# EasyEDA Pro project 2021_ZT_2.eprj

# Schematic user
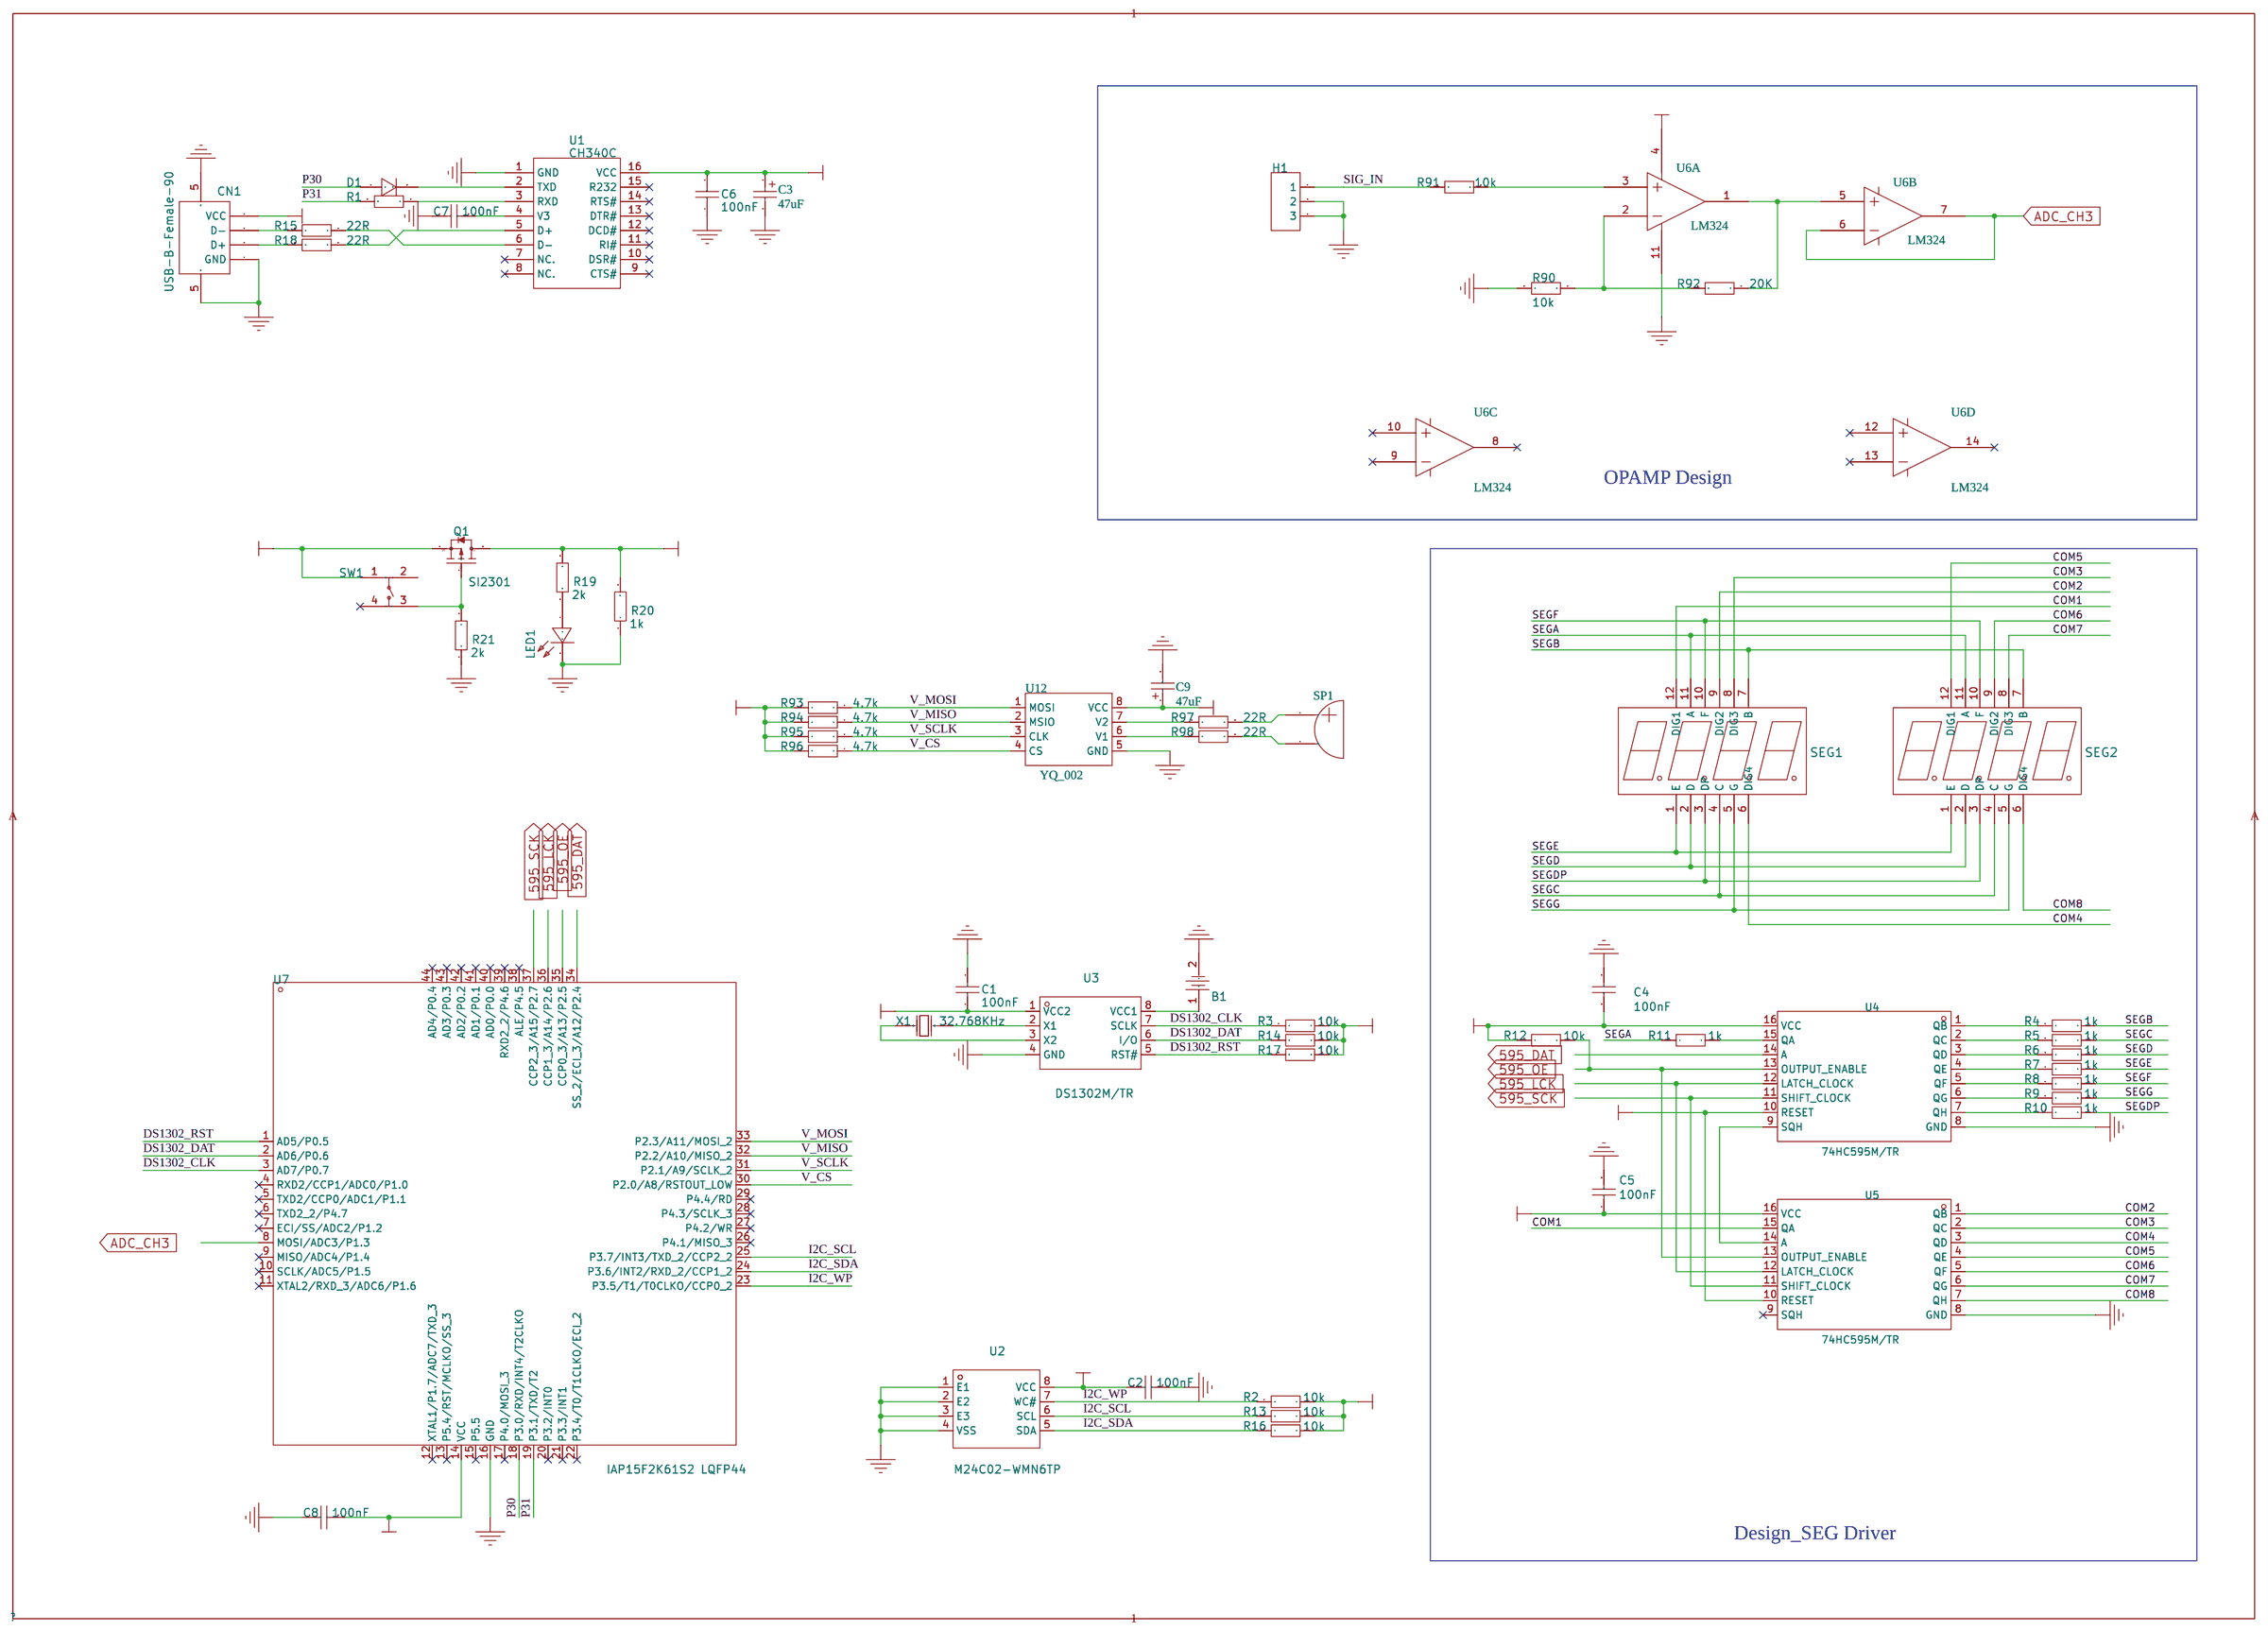
[diagram p0: schematic sheet]

## Parts
B1  CR1220-2  [BAT-CR1220]
C1  100nF  [C0805]
C2  100nF  [C0805]
C3  47uF  [CAP]
C4  100nF  [C0805]
C5  100nF  [C0805]
C6  100nF  [C0805]
C7  100nF  [C0805]
C8  100nF  [C0805]
C9  47uF  [CAP]
CN1  USB-B-Female-90  [USB-B]
D1  KLL4148  [DIODE]
H1  HDR-F-2.54_1x3  [HDR-F-2.54_1X3]
LED1  17-21URC/TR8  [LED0805]
Q1  SI2301  [SOT-23-3]
R1  1k  [R0805]
R2  10k  [R0805]
R3  10k  [R0805]
R4  1k  [R0805]
R5  1k  [R0805]
R6  1k  [R0805]
R7  1k  [R0805]
R8  1k  [R0805]
R9  1k  [R0805]
R10  1k  [R0805]
R11  1k  [R0805]
R12  10k  [R0805]
R13  10k  [R0805]
R14  10k  [R0805]
R15  22R  [R0805]
R16  10k  [R0805]
R17  10k  [R0805]
R18  22R  [R0805]
R19  2k  [R0805]
R20  1k  [R0805]
R21  2k  [R0805]
R90  10k  [R0805]
R91  10k  [R0805]
R92  20K  [R0805]
R93  4.7k  [R0805]
R94  4.7k  [R0805]
R95  4.7k  [R0805]
R96  4.7k  [R0805]
R97  22R  [R0805]
R98  22R  [R0805]
SEG1  DSP  [led-seg-th_12p-l30.0-w14.0-p2.54-s10.16-bl]
SEG2  DSP  [led-seg-th_12p-l30.0-w14.0-p2.54-s10.16-bl]
SP1  BUZZER  [BUZZ]
SW1  TS-1159UB-B-D-BL  [SW-SMD_4P]
U1  CH340C  [SOP-16]
U2  M24C02-WMN6TP  [SOP-8]
U3  DS1302M/TR  [SOP-8]
U4  74HC595M/TR  [sop-16]
U5  74HC595M/TR  [sop-16]
U6  LM324  [SO-14]  (sections 1,2,3,4)
U7  IAP15F2K61S2 LQFP44  [LQFP-44]
U12  YQ_002  [BW-SOP-8]
X1  32.768KHz  [XTAL-DT38]

## Library data of the parts
B1 = CR1220-2: Supplier: LCSC; Manufacturer: Q&amp;J; image: //image.lceda.cn/szlcsc/C70381.jpg; Supplier Part: C70381
C1 C2 C4-C8 = 100nF: Supplier: LCSC; Manufacturer: FH; Manufacturer Part: 0805F104M500NT; Supplier Part: C28378
C3 C9 = 47uF: Polarized Capacitor (Axial); Design Item ID: Cap Pol2; Library Name: Miscellaneous Devices
CN1 = USB-B-Female-90: Supplier: LCSC; Manufacturer: ValuePro; Manufacturer Part: USB-BF90; image: //image.lceda.cn/szlcsc/C46392.jpg; Supplier Part: C46392
D1 = KLL4148: Supplier: LCSC; Supplier Part: C369941; Manufacturer: KEXIN
H1 = HDR-F-2.54_1x3: Supplier Part: C146690; Supplier: LCSC; Library Name: CT105
LED1 = 17-21URC/TR8: Supplier: LCSC; Supplier Part: C264414; Manufacturer: Everlight Elec
Q1 = SI2301: Supplier: LCSC; Manufacturer: Hottech; Supplier Part: C181086; JLCPCB Part Class: Extend
R1 R20 = 1k: Supplier: LCSC; Manufacturer: UniOhm; Manufacturer Part: 080500J0104T5E; Supplier Part: C149503
R2-R14 R16 R17 = 10k: Supplier: LCSC; Manufacturer: UniOhm; Manufacturer Part: 080500J0104T5E; Supplier Part: C149503
R15 R18 R97 R98 = 22R: Supplier: LCSC; Manufacturer: UniOhm; Manufacturer Part: 080500J0104T5E; Supplier Part: C149503; Design Item ID: 1k
R19 R21 = 2k: Supplier: LCSC; Manufacturer: UniOhm; Manufacturer Part: 080500J0104T5E; Supplier Part: C149503
R90 R91 = 10k: Supplier: LCSC; Manufacturer: UniOhm; Manufacturer Part: 080500J0104T5E; Supplier Part: C149503; Design Item ID: 1k
R92 = ?: Supplier: LCSC; Manufacturer: UniOhm; Manufacturer Part: 080500J0104T5E; Supplier Part: C149503; Design Item ID: 1k
R93-R96 = 4.7k: Supplier: LCSC; Manufacturer: UniOhm; Manufacturer Part: 080500J0104T5E; Supplier Part: C149503; Design Item ID: 1k
SEG1 SEG2 = SR420361N: Supplier: LCSC; Supplier Part: C98926; Manufacturer: Wuxi ARK Tech Elec
SP1 = BUZZER: Buzzer; Library Name: *
SW1 = TS-1159UB-B-D-BL: Supplier: LCSC; Supplier Part: C692480; Manufacturer: XKB Connectivity
U1 = CH340C: Supplier: LCSC; Manufacturer: WCH; Supplier Part: C84681; JLCPCB Part Class: Extend
U2 = M24C02-WMN6TP: Supplier: LCSC; Manufacturer: STMicroelectronics; image: //image.lceda.cn/szlcsc/C7562.jpg; Supplier Part: C7562; JLCPCB Part Class: Basic
U3 = DS1302M/TR: Supplier: LCSC; Supplier Part: C434511; Manufacturer: HGSEMI
U4 U5 = 74HC595M/TR
U6 = LM324: Design Item ID: LM124; Library Name: *
U7 = IAP15F2K61S2 LQFP44: Supplier: LCSC; Manufacturer: STC; Supplier Part: C47451; JLCPCB Part Class: Extend
U12 = YQ_002: Design Item ID: LQ2021; Library Name: CT105
X1 = 32.768KHz: Supplier: LCSC; Supplier Part: C252404; Manufacturer: SHENZHEN CRYSTAL TECH; Manufacturer Part: 6K832768F12UB

## Nets
+5V: C1.1 C2.1 C4.1 C5.1 C8.2 C9.1 Q1.3(D) R2.2 R3.2 R12.1 R13.2 R14.2 R16.2 R17.2 R19.2 R20.2 R93.2 R94.2 R95.2 R96.2 U2.8(VCC) U3.1(VCC2) U4.10(RESET) U4.16(VCC) U5.10(RESET) U5.16(VCC) U6.4 U7.14(VCC) U12.8(VCC)
GND: B1.2 C1.2 C2.2 C3.2 C4.2 C5.2 C6.1 C7.1 C8.1 C9.2 CN1.4(GND) CN1.5(SH2) H1.2 H1.3 LED1.2(K) R20.1 R21.1 R90.2 U1.1(GND) U2.1(E1) U2.2(E2) U2.3(E3) U2.4(VSS) U3.4(GND) U4.8(GND) U5.8(GND) U6.11 U7.16(GND) U12.5(GND)
595_DAT: U4.14(A) U7.34(SS_2/ECI_3/A12/P2.4)
595_LCK: U4.12(LATCH_CLOCK) U5.12(LATCH_CLOCK) U7.36(CCP1_3/A14/P2.6)
595_OE: R12.2 U4.13(OUTPUT_ENABLE) U5.13(OUTPUT_ENABLE) U7.35(CCP0_3/A13/P2.5)
595_SCK: U4.11(SHIFT_CLOCK) U5.11(SHIFT_CLOCK) U7.37(CCP2_3/A15/P2.7)
ADC_CH3: U6.6 U6.7 U7.8(MOSI/ADC3/P1.3)
COM1: SEG1.12(DIG1) U5.15(QA)
COM2: SEG1.9(DIG2) U5.1(QB)
COM3: SEG1.8(DIG3) U5.2(QC)
COM4: SEG1.6(DIG4) U5.3(QD)
COM5: SEG2.12(DIG1) U5.4(QE)
COM6: SEG2.9(DIG2) U5.5(QF)
COM7: SEG2.8(DIG3) U5.6(QG)
COM8: SEG2.6(DIG4) U5.7(QH)
DS1302_CLK: R3.1 U3.7(SCLK) U7.3(AD7/P0.7)
DS1302_DAT: R14.1 U3.6(I/O) U7.2(AD6/P0.6)
DS1302_RST: R17.1 U3.5(RST#) U7.1(AD5/P0.5)
I2C_SCL: R13.1 U2.6(SCL) U7.25(P3.7/INT3/TXD_2/CCP2_2)
I2C_SDA: R16.1 U2.5(SDA) U7.24(P3.6/INT2/RXD_2/CCP1_2)
I2C_WP: R2.1 U2.7(WC#) U7.23(P3.5/T1/T0CLKO/CCP0_2)
P30: D1.2(A) U7.18(P3.0/RXD/INT4/T2CLKO)
P31: R1.2 U7.19(P3.1/TXD/T2)
SEGA: R11.1 SEG1.11(A) SEG2.11(A)
SEGB: R4.2 SEG1.7(B) SEG2.7(B)
SEGC: R5.2 SEG1.4(C) SEG2.4(C)
SEGD: R6.2 SEG1.2(D) SEG2.2(D)
SEGDP: R10.2 SEG1.3(DP) SEG2.3(DP)
SEGE: R7.2 SEG1.1(E) SEG2.1(E)
SEGF: R8.2 SEG1.10(F) SEG2.10(F)
SEGG: R9.2 SEG1.5(G) SEG2.5(G)
SIG_IN: H1.1 R91.2
V_CS: R96.1 U7.30(P2.0/A8/RSTOUT_LOW) U12.4(CS)
V_MISO: R94.1 U7.32(P2.2/A10/MISO_2) U12.2(MSIO)
V_MOSI: R93.1 U7.33(P2.3/A11/MOSI_2) U12.1(MOSI)
V_SCLK: R95.1 U7.31(P2.1/A9/SCLK_2) U12.3(CLK)
VUSB: C3.1 C6.2 CN1.1(VCC) Q1.2(S) SW1.1 U1.16(VCC)
$1N560: U3.2(X1) X1.2(OSC2)
$1N561: U3.3(X2) X1.1(OSC1)
$1N593: B1.1 U3.8(VCC1)
$1N600: R1.1 U1.3(RXD)
$1N601: D1.1(C) U1.2(TXD)
$1N604: C7.2 U1.4(V3)
$1N605: CN1.2(D-) R15.2
$1N606: CN1.3(D+) R18.2
$1N607: R15.1 U1.6(D-)
$1N608: R18.1 U1.5(D+)
$1N627: Q1.1(G) R21.2 SW1.3
$1N632: R91.1 U6.3
$1N637: R92.1 U6.1 U6.5
$1N638: R90.1 R92.2 U6.2
$1N646: R98.1 U12.6(V1)
$1N647: R97.1 U12.7(V2)
$1N661: R97.2 SP1.1
$1N662: R98.2 SP1.2
$1N687: LED1.1(A) R19.1
$1N2494: R11.2 U4.15(QA)
$1N2978: R4.1 U4.1(QB)
$1N2981: R5.1 U4.2(QC)
$1N2984: R6.1 U4.3(QD)
$1N2987: R7.1 U4.4(QE)
$1N2990: R8.1 U4.5(QF)
$1N2993: R9.1 U4.6(QG)
$1N2999: R10.1 U4.7(QH)
$1N3336: U4.9(SQH) U5.14(A)

Not connected (* = marked no-connect by the designer): SW1 2 4*; U1 7(NC.)* 8(NC.)* 9(CTS#)* 10(DSR#)* 11(RI#)* 12(DCD#)* 13(DTR#)* 14(RTS#)* 15(R232)*; U5 9(SQH)*; U6 8* 9* 10* 12* 13* 14*; U7 4(RXD2/CCP1/ADC0/P1.0)* 5(TXD2/CCP0/ADC1/P1.1)* 6(TXD2_2/P4.7)* 7(ECI/SS/ADC2/P1.2)* 9(MISO/ADC4/P1.4)* 10(SCLK/ADC5/P1.5)* 11(XTAL2/RXD_3/ADC6/P1.6)* 12(XTAL1/P1.7/ADC7/TXD_3)* 13(P5.4/RST/MCLKO/SS_3)* 15(P5.5)* 17(P4.0/MOSI_3)* 20(P3.2/INT0)* 21(P3.3/INT1)* 22(P3.4/T0/T1CLKO/ECI_2)* 26(P4.1/MISO_3)* 27(P4.2/WR)* 28(P4.3/SCLK_3)* 29(P4.4/RD)* 38(ALE/P4.5)* 39(RXD2_2/P4.6)* 40(AD0/P0.0)* 41(AD1/P0.1)* 42(AD2/P0.2)* 43(AD3/P0.3)* 44(AD4/P0.4)*

## Notes on the sheet
- OPAMP Design
- Design_SEG Driver

# Board PCB2
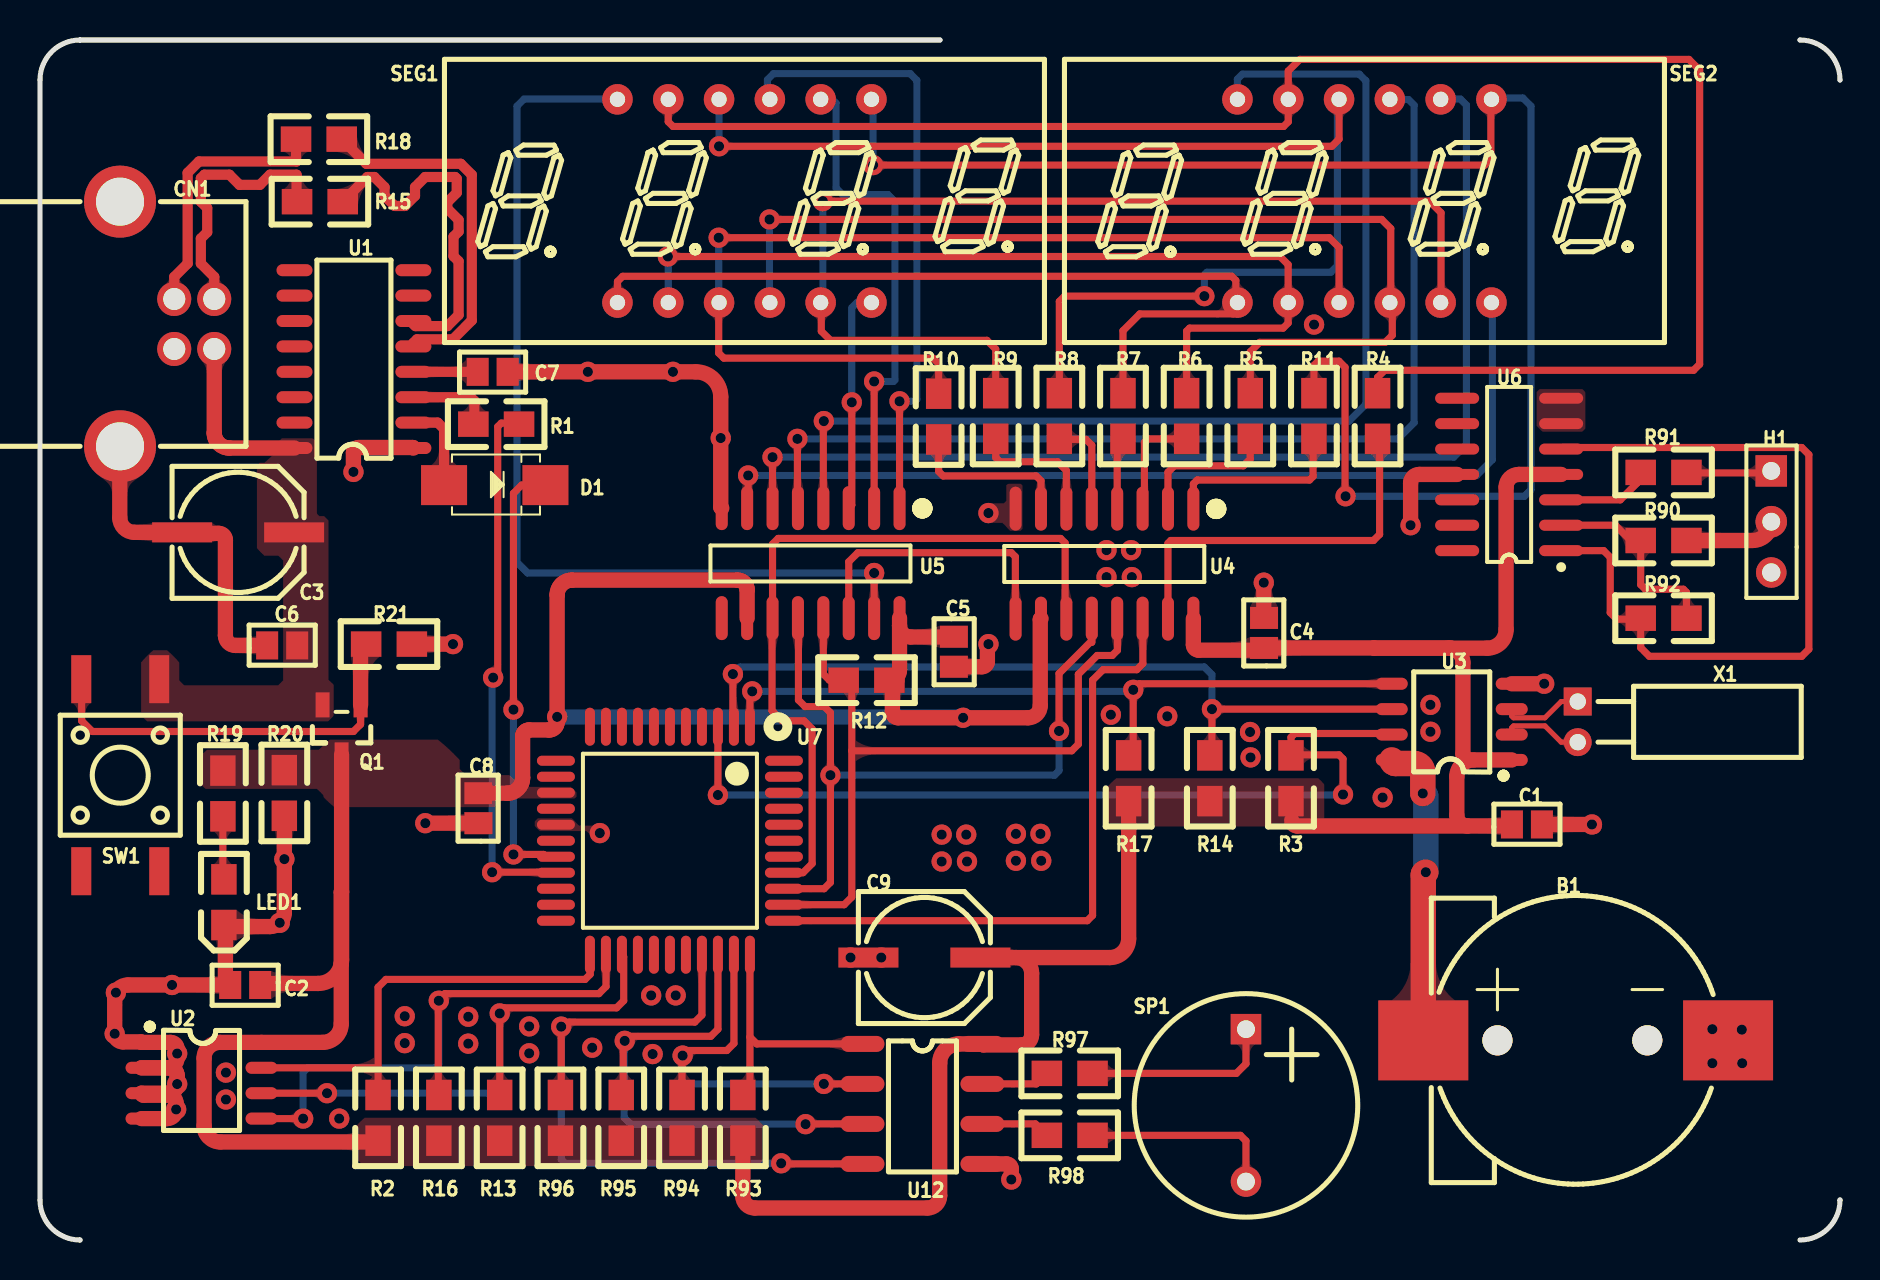
[diagram p1: board, top side]
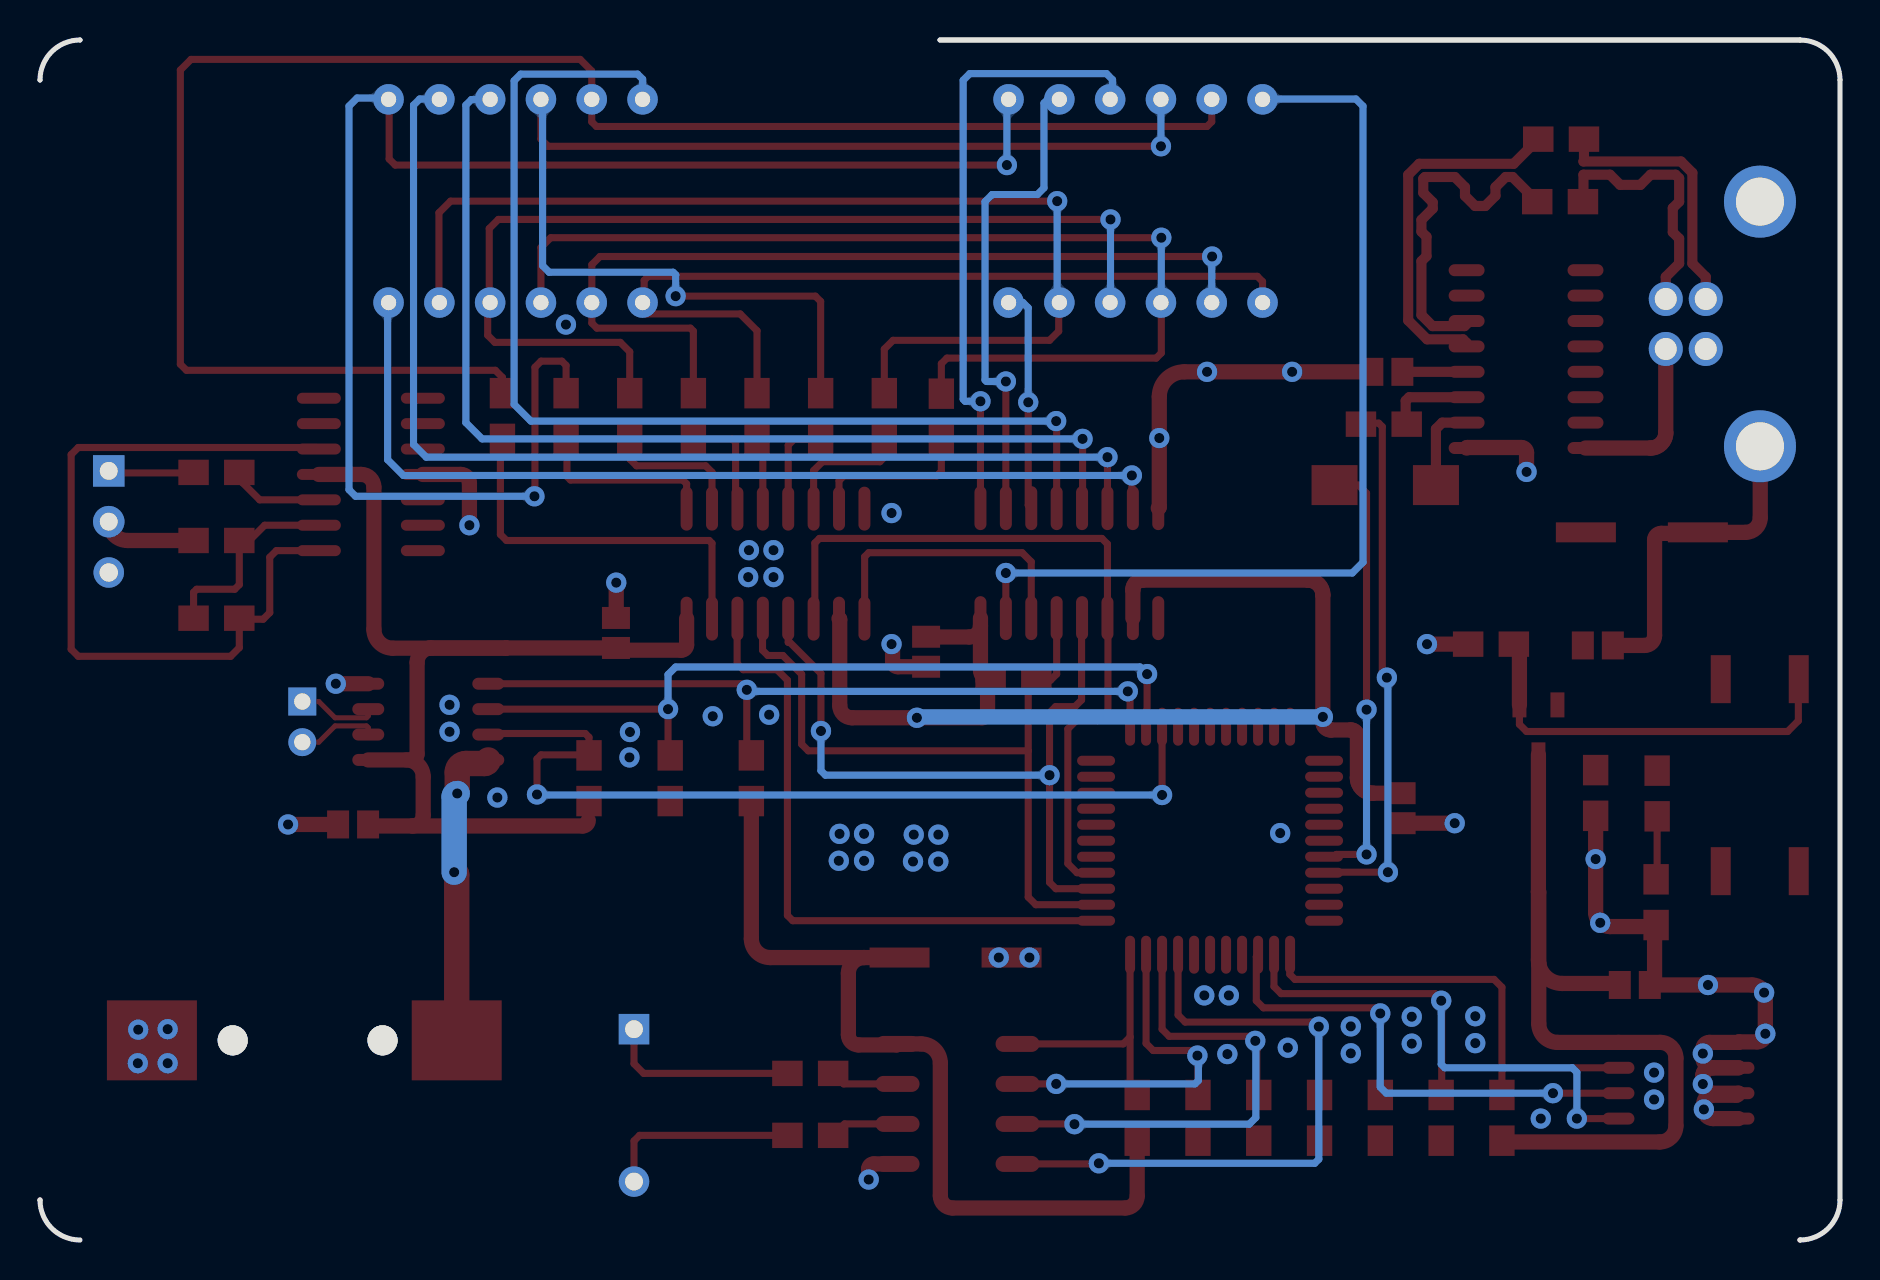
[diagram p2: board, bottom side, seen from below]

Outline 90 x 60 mm; copper layers: Top Layer, Bottom Layer. Coordinates in mm from the lower left corner of the outline.
Outline path: 2,60 arc(0.59,59.41) 0,58 0,2 arc(0.59,0.59) 2,0 ; 2,60 45,60 2,60 ; 88,60 88,60 arc(89.41,59.41) 90,58 90,58 ; 90,2 arc(89.41,0.59) 88,0
Stack: Top Layer 0.035mm / Dielectric1 1.51mm FR4 er 4.5 / Bottom Layer 0.035mm

## Design rules (mm)
net $1N560: DP3
net $1N561: DP3
net $1N608: DP2
net $1N607: DP2
net $1N606: DP1
net $1N605: DP1
template: 自定义配置
spacing copperThickness1oz (default): track to track 0.356, other pairs 0.203 to 0.762
track width copperThickness1oz (default): min 0.356, default 0.356, max 2.54
track width copperThickness2oz: min 0.203, default 0.254, max 2.54
track width PWR: min 0.508, default 0.762, max 2.54
differential pair differentialPair (default): width min 0.127, default 0.254, max 2.54; gap min 0.152, default 0.152
via viaSize (default): diameter min 0.5, default 1.016, max 10; hole min 0.3, default 0.508, max 6.299
net +5V uses PWR
net GND uses PWR
net VUSB uses PWR

## Placement (name value [footprint] x y rotation side)
B1  CR1220-2  [BAT-CR1220]  76.78 9.98 0 top
C1  100nF  [C0805]  74.35 20.78 0 top
C2  100nF  [C0805]  10.26 12.75 180 top
C3  47uF  [CAP]  9.91 35.38 180 top
C4  100nF  [C0805]  61.2 30.35 90 top
C5  100nF  [C0805]  45.69 29.41 270 top
C6  100nF  [C0805]  12.11 29.73 0 top
C7  100nF  [C0805]  22.63 43.41 180 top
C8  100nF  [C0805]  21.92 21.59 90 top
C9  47uF  [CAP]  44.22 14.12 180 top
CN1  USB-B-Female-90  [USB-B]  8.71 44.55 270 top
D1  KLL4148  [DIODE]  20.19 37.74 0 top
H1  HDR-F-2.54_1x3  [HDR-F-2.54_1X3]  86.56 35.92 270 top
LED1  17-21URC/TR8  [LED0805]  9.2 15.75 90 top
Q1  SI2301  [SOT-23-3]  15.08 25.51 90 top
R1  1k  [R0805]  21.67 40.79 0 top
R2  10k  [R0805]  16.9 7.25 270 top
R3  10k  [R0805]  62.55 24.23 270 top
R4  1k  [R0805]  63.7 40.06 90 top
R5  1k  [R0805]  60.51 40.06 90 top
R6  1k  [R0805]  57.33 40.06 90 top
R7  1k  [R0805]  54.15 40.06 90 top
R8  1k  [R0805]  50.97 40.06 90 top
R9  1k  [R0805]  47.78 40.06 90 top
R10  1k  [R0805]  44.93 40.03 90 top
R11  1k  [R0805]  66.88 42.34 270 top
R12  10k  [R0805]  42.47 27.99 180 top
R13  10k  [R0805]  22.98 7.25 270 top
R14  10k  [R0805]  58.49 24.23 270 top
R15  22R  [R0805]  15.14 51.92 180 top
R16  10k  [R0805]  19.94 7.25 270 top
R17  10k  [R0805]  54.43 24.23 270 top
R18  22R  [R0805]  15.09 55.04 180 top
R19  2k  [R0805]  9.14 21.18 90 top
R20  1k  [R0805]  12.22 21.21 90 top
R21  2k  [R0805]  18.59 29.79 180 top
R90  10k  [R0805]  80.04 34.98 0 top
R91  10k  [R0805]  80.04 38.38 0 top
R92  20K  [R0805]  80.04 31.09 0 top
R93  4.7k  [R0805]  35.14 7.25 270 top
R94  4.7k  [R0805]  32.1 7.25 270 top
R95  4.7k  [R0805]  29.06 7.25 270 top
R96  4.7k  [R0805]  26.02 7.25 270 top
R97  22R  [R0805]  50.34 8.33 0 top
R98  22R  [R0805]  50.34 5.23 0 top
SEG1  DSP  [led-seg-th_12p-l30.0-w14.0-p2.54-s10.16-bl]  35.22 51.95 0 top
SEG2  DSP  [led-seg-th_12p-l30.0-w14.0-p2.54-s10.16-bl]  66.22 51.95 0 top
SP1  BUZZER  [BUZZ]  60.3 10.54 270 top
SW1  TS-1159UB-B-D-BL  [SW-SMD_4P]  4.01 23.24 270 top
U1  CH340C  [SOP-16]  15.7 44.04 90 top
U2  M24C02-WMN6TP  [SOP-8]  8.08 7.98 270 top
U3  DS1302M/TR  [SOP-8]  70.59 25.91 90 top
U4  74HC595M/TR  [sop-16]  57.67 36.57 270 top
U5  74HC595M/TR  [sop-16]  42.98 36.59 270 top
U6  LM324  [SO-14]  73.46 38.28 90 top
U7  IAP15F2K61S2 LQFP44  [LQFP-44]  28.96 27.97 270 top
U12  YQ_002  [BW-SOP-8]  41.12 9.8 0 top
X1  32.768KHz  [XTAL-DT38]  76.89 26.92 90 top

## Footprints (pads in the part's own frame, mm; a bottom-side part is the same pattern mirrored in y, then rotated)
BAT-CR1220
  rect 4.5x4 smd: 1(-7.62,0) 2(7.62,0)
  round 1.5 hole 1.5: 3(3.582,0) 4(-3.912,0)
BUZZ
  rect 1.524x1.524 hole 0.889: 1(0,0)
  round 1.524 hole 0.889: 2(7.62,0)
BW-SOP-8
  oval 2.2x0.8 smd: 1(0,0) 2(0,-2) 3(0,-4) 4(0,-6) 5(6,-6) 6(6,-4) 7(6,-2) 8(6,0)
C0805
  rect 1.1x1.4 smd: 1(-0.75,0) 2(0.75,0)
CAP
  rect 3x1 smd: 1(-2.8,0) 2(2.8,0)
DIODE
  rect 2.3x2 smd: 1(0.01,0) 2(5.08,0)
HDR-F-2.54_1X3
  rect 1.575x1.575 hole 0.889: 1(-2.54,0)
  round 1.575 hole 0.889: 2(0,0)
  round 1.524 hole 0.914: 3(2.54,0)
LED0805
  rect 1.524x1.27 smd: 1(2.286,0) 2(0,0)
led-seg-th_12p-l30.0-w14.0-p2.54-s10.16-bl
  round 1.524 hole 0.762: 1(-6.35,-5.08) 2(-3.81,-5.08) 3(-1.27,-5.08) 4(1.27,-5.08) 5(3.81,-5.08) 6(6.35,-5.08) 7(6.35,5.08) 8(3.81,5.08) 9(1.27,5.08) 10(-1.27,5.08) 11(-3.81,5.08) 12(-6.35,5.08)
LQFP-44
  oval 1.9x0.5 smd: 1(2.301,6.54) 2(2.301,5.74) 3(2.301,4.94) 4(2.301,4.14) 5(2.301,3.34) 6(2.301,2.54) 7(2.301,1.74) 8(2.301,0.94) 9(2.301,0.14) 10(2.301,-0.66) 11(2.301,-1.46) 23(13.701,-1.46) 24(13.701,-0.66) 25(13.701,0.14) 26(13.701,0.94) 27(13.701,1.74) 28(13.701,2.54) 29(13.701,3.34) 30(13.701,4.14) 31(13.701,4.94) 32(13.701,5.74) 33(13.701,6.54)
  oval 0.5x1.9 smd: 12(4.001,-3.16) 13(4.801,-3.16) 14(5.601,-3.16) 15(6.401,-3.16) 16(7.201,-3.16) 17(8.001,-3.16) 18(8.801,-3.16) 19(9.601,-3.16) 20(10.401,-3.16) 21(11.201,-3.16) 22(12.001,-3.16) 34(12.001,8.24) 35(11.201,8.24) 36(10.401,8.24) 37(9.601,8.24) 38(8.801,8.24) 39(8.001,8.24) 40(7.201,8.24) 41(6.401,8.24) 42(5.601,8.24) 43(4.801,8.24) 44(4.001,8.24)
R0805
  rect 1.524x1.27 smd: 1(0,0) 2(2.286,0)
SO-14
  oval 0.55x2.2 smd: 1(-3.81,-2.6) 2(-2.54,-2.6) 3(-1.27,-2.6) 4(0,-2.6) 5(1.27,-2.6) 6(2.54,-2.6) 7(3.81,-2.6) 8(3.81,2.6) 9(2.54,2.6) 10(1.27,2.6) 11(0,2.6) 12(-1.27,2.6) 13(-2.54,2.6) 14(-3.81,2.6)
SOP-8
  oval 0.6x1.598 smd: 1(-1.905,-3) 2(-0.635,-3) 3(0.635,-3) 4(1.905,-3) 5(1.905,3) 6(0.635,3) 7(-0.635,3) 8(-1.905,3)
SOP-16
  oval 0.6x1.798 smd: 1(-4.445,-2.972) 2(-3.175,-2.972) 3(-1.905,-2.972) 4(-0.635,-2.972) 5(0.635,-2.972) 6(1.905,-2.972) 7(3.175,-2.972) 8(4.445,-2.972) 9(4.445,2.972) 10(3.175,2.972) 11(1.905,2.972) 12(0.635,2.972) 13(-0.635,2.972) 14(-1.905,2.972) 15(-3.175,2.972) 16(-4.445,2.972)
sop-16
  oval 2.198x0.6 smd: 1(0,0) 2(0,-1.27) 3(0,-2.54) 4(0,-3.81) 5(0,-5.08) 6(0,-6.35) 7(0,-7.62) 8(0,-8.89) 9(5.5,-8.89) 10(5.5,-7.62) 11(5.5,-6.35) 12(5.5,-5.08) 13(5.5,-3.81) 14(5.5,-2.54) 15(5.5,-1.27) 16(5.5,0)
SOT-23-3
  rect 1.25x0.7 smd: 1(1.25,-0.95) 2(1.25,0.95) 3(-1.25,0)
SW-SMD_4P
  rect 2.4x1 smd: 1(-4.8,1.95) 2(4.8,1.95) 3(-4.8,-1.95) 4(4.8,-1.95)
USB-B
  round 1.7 hole 1.1: 1(0,0) 2(-2.5,0) 3(-2.5,-2) 4(0,-2)
  round 3.6 hole 2.4: 5(-7.367,-4.71) 5(4.867,-4.71)
XTAL-DT38
  rect 1.397x1.397 hole 0.813: 1(0,0)
  round 1.397 hole 0.813: 2(-2.032,0)

## Nets
As in the schematic, except:
ADC_CH3: U6.6 U6.7
$1N596: U4.14 U7.34
$1N597: R12.2 U4.13 U5.13 U7.35
$1N598: U4.12 U5.12 U7.36
$1N599: U4.11 U5.11 U7.37

Pads without a net: B1 3 4; SW1 2 4; U1 7 8 9 10 11 12 13 14 15; U5 9; U6 8 9 10 12 13 14; U7 4 5 6 7 9 10 11 12 13 15 17 20 21 22 26 27 28 29 38 39 40 41 42 43 44

## Via types
v1: diameter 1.016, hole 0.508, Top Layer to Bottom Layer, 103 vias

## Routing (per net, layer and track width the routed paths; a pad name or vN(x,y) marks a point on that pad's centre or on a via; arc(x,y) is an arc through that point)
+5V: length 211.5
  Top Layer w0.762: 66.69,29.6 C4.1 arc(61.17,29.52) 61.09,29.49 57.94,29.49 arc(57.75,29.57) 57.67,29.76 U4.16 ; 66.69,29.6 70.42,29.6 arc(70.49,29.6) 70.55,29.59 ; 66.69,29.6 arc(66.7,29.59) 66.7,29.59 70.55,29.59 ; Q1.3 15.08,17.41 ; 15.08,17.41 15.08,14.01 arc(15.07,13.91) 15.06,13.82 ; 15.08,17.41 arc(15.07,17.41) 15.06,17.39 15.06,13.82 ; 24.46,25.5 25.45,25.5 ; 24.46,25.5 arc(24.23,25.4) 24.13,25.17 ; 24.46,25.5 arc(24.23,25.4) 24.13,25.17 ; 25.45,25.5 arc(25.74,25.62) 25.86,25.91 ; 25.45,25.5 arc(25.74,25.62) 25.86,25.91 ; C8.2 23.36,22.34 ; 23.36,22.34 arc(23.9,22.57) 24.13,23.11 ; 23.36,22.34 arc(23.9,22.57) 24.13,23.11 ; 15.06,13.82 15.06,10.82 arc(14.79,10.16) 14.12,9.88 U2.8 8.99,9.88 arc(8.43,9.65) 8.2,9.09 8.2,5.72 arc(8.44,5.14) 9.02,4.9 16.84,4.9 arc(16.88,4.92) R2.2 ; 15.06,13.82 arc(14.66,13.11) 13.89,12.83 11.09,12.83 arc(11.03,12.8) C2.1 ; 71.37,20.7 62.86,20.7 arc(62.67,20.78) 62.59,20.98 ; 71.37,20.7 73.52,20.7 arc(73.57,20.72) C1.1 ; 71.37,20.7 arc(71,20.86) 70.84,21.23 70.84,23.17 arc(71.09,23.76) 71.68,24 U3.1 ; U5.16 42.98,30.71 ; 42.98,30.71 42.98,28.5 arc(42.83,28.14) R12.1 ; 42.98,30.71 arc(43.14,30.31) 43.54,30.15 45.68,30.15 arc(45.69,30.15) C5.1 ; 48.79,14.12 53.49,14.12 arc(54.16,14.4) 54.43,15.06 R17.2 ; 48.79,14.12 C9.1 ; 48.79,14.12 arc(49.35,13.89) 49.58,13.33 49.58,10.26 arc(49.43,9.9) 49.07,9.75 47.17,9.75 arc(47.14,9.77) U12.8 45.95,9.8 arc(45.27,9.52) 44.98,8.84 44.98,2.21 arc(44.81,1.78) 44.37,1.6 35.74,1.6 arc(35.32,1.77) 35.14,2.2 R93.2 ; U6.4 73.94,38.28 arc(73.49,38.09) 73.3,37.64 73.3,30.53 arc(73.03,29.87) 72.36,29.59 70.55,29.59 ; 25.86,25.91 25.86,32.26 ; 25.86,32.26 arc(26.07,32.78) 26.59,32.99 ; 25.86,32.26 arc(26.07,32.78) 26.59,32.99 ; 70.55,29.59 arc(70.98,29.34) 71.15,28.88 71.15,24.31 arc(71.23,24.11) 71.42,24.03 ; 35.36,32.51 U5.10 ; 35.36,32.51 arc(35.22,32.85) 34.87,32.99 ; 35.36,32.51 arc(35.22,32.85) 34.87,32.99 ; 24.13,23.11 24.13,25.17 ; 26.59,32.99 34.87,32.99 ; U4.10 arc(50.02,31.06) 50.01,31.03 50.01,26.72 arc(49.83,26.29) 49.4,26.11 v1(46.16,26.11) 42.9,26.11 arc(42.7,26.19) 42.62,26.39 42.62,27.74 arc(42.69,27.9) 42.85,27.97
  Bottom Layer w0.762: v1(25.86,26.16) 46.11,26.16 arc(46.14,26.14) v1(46.16,26.11)
GND: length 98.6
  Top Layer w0.762: R20.1 v1(12.22,19.04) 12.22,16.38 arc(12.16,16.1) v1(11.99,15.86) arc(11.77,15.72) 11.51,15.67 9.27,15.67 ; C5.2 47.1,28.66 arc(47.29,28.74) 47.37,28.93 47.37,29.74 arc(47.39,29.78) v1(47.42,29.79) ; v1(48.57,3.02) 48.57,3.56 arc(48.49,3.73) 48.32,3.8 U12.5 ; 9.27,15.67 9.27,12.99 arc(9.34,12.82) C2.2 v1(6.6,12.75) 4.39,12.75 arc(3.93,12.56) 3.73,12.09 v1(3.73,10.31) arc(3.85,10.03) 4.14,9.91 5.05,9.91 arc(5.07,9.9) U2.1 6.53,9.88 arc(6.76,9.78) 6.86,9.55 6.86,9.12 arc(6.71,8.76) 6.35,8.61 U2.2 6.45,8.61 ; 9.27,15.67 arc(9.22,15.69) LED1.2 ; 6.45,8.61 arc(6.74,8.49) 6.86,8.2 ; 6.45,8.61 arc(6.74,8.49) 6.86,8.2 ; R21.1 v1(20.65,29.79) ; C6.1 9.77,29.73 arc(9.42,29.87) 9.27,30.23 9.27,35 arc(9.17,35.23) 8.94,35.33 7.16,35.33 arc(7.12,35.35) C3.2 4.72,35.38 arc(4.2,35.6) 3.99,36.12 3.99,39.67 arc(3.99,39.68) CN1.5 ; U6.11 68.96,38.28 arc(68.66,38.15) 68.53,37.85 v1(68.53,35.74) arc(68.54,35.7) 68.58,35.69 ; v1(6.86,7.8) 6.86,8.2 ; v1(6.86,7.8) arc(6.72,7.47) 6.4,7.34 ; v1(6.86,7.8) arc(6.72,7.47) 6.4,7.34 ; C7.1 v1(27.39,43.41) v1(31.65,43.41) 32.79,43.41 arc(33.67,43.04) 34.04,42.16 v1(34.04,40.1) 34.04,36.64 arc(34.05,36.61) U5.8 ; C1.2 v1(77.6,20.78) arc(77.67,20.75) 77.7,20.68 ; U3.4 v1(75.21,27.81) arc(75.23,27.81) 75.23,27.79 ; 6.4,7.34 U2.3 arc(5.11,7.27) 5.18,7.24 6.4,7.24 arc(6.69,7.12) 6.81,6.83 v1(6.81,6.53) arc(6.67,6.2) 6.35,6.07 U2.4 ; v1(15.67,38.41) 15.67,39.37 arc(15.75,39.55) 15.93,39.62 18.64,39.62 arc(18.66,39.62) U1.1 ; R90.2 85.62,34.98 arc(86.29,35.25) H1.2 ; C4.2 61.19,31.12 v1(61.19,32.87) arc(61.14,32.79) 61.14,32.69 ; C8.1 v1(19.27,20.84) arc(19.26,20.84) 19.25,20.83
  vias: v1(3.8,12.37) v1(6.86,9.32) v1(9.3,8.37) v1(9.3,7.02) v1(14.96,6.07) v1(18.24,11.19) v1(18.24,9.84) v1(21.41,11.16) v1(21.41,9.82) v1(24.46,10.68) v1(24.46,9.33) v1(27.61,9.61) v1(27.99,20.35) v1(30.56,12.23) v1(30.63,9.3) v1(31.79,12.23) v1(40.53,14.12) v1(42.06,14.12) v1(45.08,20.27) v1(45.08,18.92) v1(46.31,20.27) v1(46.35,18.92) v1(47.42,36.35) v1(48.8,20.31) v1(48.8,18.96) v1(50.02,20.31) v1(50.06,18.96) v1(53.33,34.49) v1(53.33,33.14) v1(53.54,26.26) v1(54.55,34.49) v1(54.59,33.14) v1(56.36,26.19) v1(60.5,25.4) v1(60.53,24.13) v1(63.7,45.77) v1(67.13,22.12) v1(69.52,26.76) v1(69.52,25.41) v1(83.62,10.54) v1(83.62,8.84) v1(85.09,10.52) v1(85.11,8.84)
COM1: length 48.3
  Top Layer w0.355: v1(41.71,33.35) U5.15
  Bottom Layer w0.355: SEG1.12 28.86,57.05 24.21,57.05 23.85,56.69 23.85,33.88 24.38,33.35 v1(41.71,33.35)
COM2: length 31
  Top Layer w0.355: U5.1 v1(42.98,41.94)
  Bottom Layer w0.355: v1(42.98,41.94) 43.74,41.94 43.84,42.04 43.84,57.99 43.51,58.32 36.68,58.32 36.37,58.01 36.37,57.15 SEG1.9
COM3: length 24.6
  Top Layer w0.355: U5.2 v1(41.71,42.93)
  Bottom Layer w0.355: v1(41.71,42.93) 42.67,42.93 42.75,43 42.75,51.92 42.39,52.27 40.13,52.27 39.8,52.6 39.8,56.84 39.61,57.03 SEG1.8
COM4: length 11.2
  Top Layer w0.355: v1(40.59,41.88) 40.59,36.75 U5.3
  Bottom Layer w0.355: SEG1.6 40.85,46.87 40.59,46.61 v1(40.59,41.88)
COM5: length 55.7
  Top Layer w0.355: U5.4 39.17,40.92 v1(39.19,40.94)
  Bottom Layer w0.355: SEG2.12 59.87,57.04 59.87,58.04 60.12,58.29 65.96,58.29 66.29,57.96 66.29,41.78 65.46,40.94 v1(39.19,40.94)
COM6: length 51.9
  Top Layer w0.355: U5.5 37.87,36.62 v1(37.87,40.06)
  Bottom Layer w0.355: SEG2.9 67.5,57.02 68.43,57.02 68.71,56.74 68.71,40.87 67.89,40.06 v1(37.87,40.06)
COM7: length 55.9
  Top Layer w0.355: v1(36.63,39.14) U5.6
  Bottom Layer w0.355: v1(36.63,39.14) 70.69,39.14 71.32,39.78 71.32,56.74 71.02,57.05 70.05,57.05 SEG2.8
COM8: length 47.1
  Top Layer w0.355: U5.7 35.41,36.64 v1(35.41,38.23)
  Bottom Layer w0.355: v1(35.41,38.23) 71.83,38.23 72.62,39.01 72.62,46.83 SEG2.6
DS1302_CLK: length 45.2
  Top Layer w0.355: U7.3 v1(33.9,22.25) ; U3.7 67.54,25.32 62.74,25.32 62.55,25.14 R3.1 62.58,24.26 64.95,24.26 65.15,24.05 v1(65.15,22.28)
  Bottom Layer w0.355: v1(65.15,22.28) 64.8,22.28 64.77,22.25 v1(33.9,22.25)
DS1302_DAT: length 40
  Top Layer w0.355: R14.1 58.6,24.34 v1(58.6,26.54) U3.6 ; v1(34.65,28.3) 34.65,25.72 34.7,25.67
  Bottom Layer w0.355: v1(58.6,26.54) 58.6,28.27 58.22,28.65 35,28.65 v1(34.65,28.3)
DS1302_RST: length 37.3
  Top Layer w0.355: U3.5 54.97,27.81 v1(54.66,27.51) 54.66,24.46 R17.1 ; U7.1 35.5,27.32 v1(35.61,27.43)
  Bottom Layer w0.355: v1(35.61,27.43) 54.58,27.43 v1(54.66,27.51)
I2C_SCL: length 28.6
  Top Layer w0.355: R13.1 22.99,7.26 v1(22.99,11.33) 22.99,11.38 23.22,11.61 28.83,11.61 29.18,11.96 29.18,14.16 29.14,14.21 arc(29.14,14.22) 29.13,14.22 ; U2.6 v1(14.35,7.34)
  Bottom Layer w0.355: v1(22.99,11.33) 22.99,7.65 22.68,7.34 v1(14.35,7.34)
I2C_SDA: length 29.5
  Top Layer w0.355: R16.1 19.91,7.28 19.91,11.99 20.24,12.32 27.95,12.32 28.3,12.67 28.3,14.24 arc(28.3,14.25) 28.29,14.25 ; U2.5 v1(13.16,6.07)
  Bottom Layer w0.355: v1(19.94,11.96) 19.94,8.79 19.76,8.61 13.39,8.61 13.16,8.38 v1(13.16,6.07)
I2C_WP: length 23.1
  Top Layer w0.355: 16.9,8.51 16.8,8.61 U2.7 ; 16.9,8.51 16.9,12.64 17.3,13.03 27.25,13.03 27.51,13.28 27.51,14.25 arc(27.5,14.26) U7.23 ; 16.9,8.51 R2.1
P30: length 22
  Top Layer w0.355: v1(23.67,26.52) 23.67,37.34 24.08,37.74 D1.2 ; v1(23.67,19.28) 25.18,19.28 25.29,19.16 U7.18
  Bottom Layer w0.355: v1(23.67,26.52) v1(23.67,19.28)
P31: length 26.8
  Top Layer w0.355: U7.19 25.77,18.39 v1(22.61,18.39) ; v1(22.66,28.12) 22.89,28.35 22.89,40.67 23.06,40.84 23.9,40.84 23.95,40.79
  Bottom Layer w0.355: v1(22.66,28.12) 22.61,28.07 v1(22.61,18.39)
SEGA: length 87.8
  Top Layer w0.355: SEG1.11 31.41,55.91 31.65,55.68 62.18,55.68 62.41,55.91 SEG2.11 62.41,58.45 62.99,59.03 82.45,59.03 82.98,58.5 82.98,43.79 82.68,43.48 67.23,43.48 66.88,43.13 R11.1
SEGB: length 77.8
  Top Layer w0.355: v1(41.66,53.75) 72.24,53.75 72.54,54.05 72.54,57 SEG2.7 ; R4.2 63.7,43.73 63.91,43.94 64.95,43.94 65.25,43.64 65.25,37.21 v1(65.28,37.19)
  Bottom Layer w0.355: SEG2.7 72.64,57.1 74.14,57.1 74.55,56.69 74.55,37.52 74.22,37.19 v1(65.28,37.19) ; 41.55,53.64 v1(41.66,53.75) 41.66,56.95 SEG1.7
SEGC: length 50.3
  Top Layer w0.355: v1(36.47,51.03) 67.08,51.03 67.54,50.57 67.54,46.92 SEG2.4 67.61,46.75 67.61,45.24 67.26,44.88 60.99,44.88 60.51,44.41 R5.2
  Bottom Layer w0.355: v1(36.47,51.03) 36.47,46.89 SEG1.4
SEGD: length 44.8
  Top Layer w0.355: v1(31.39,49.17) 62,49.17 62.41,48.77 62.41,46.88 SEG2.2 62.41,46.87 62.41,45.85 62.15,45.59 57.48,45.59 57.33,45.44 R6.2
  Bottom Layer w0.355: SEG1.2 31.41,49.16 v1(31.39,49.17)
SEGDP: length 52.5
  Top Layer w0.355: v1(33.93,50.11) 64.47,50.11 64.95,49.63 SEG2.3 ; SEG1.3 33.93,46.85 33.93,44.35 34.19,44.09 44.65,44.09 44.93,43.81 R10.2
  Bottom Layer w0.355: v1(33.93,50.11) 33.93,46.89 SEG1.3
SEGE: length 42.9
  Top Layer w0.355: R7.2 54.15,45.46 54.99,46.3 59.64,46.3 59.87,46.54 SEG2.1 59.79,46.95 59.79,47.98 59.59,48.18 29.13,48.18 28.87,47.92 SEG1.1
SEGF: length 63.7
  Top Layer w0.355: v1(58.22,47.19) 51.23,47.19 50.97,46.93 R8.2 ; SEG2.10 64.95,55.05 64.59,54.69 v1(33.95,54.69)
  Bottom Layer w0.355: v1(58.22,47.19) 58.22,48.26 58.34,48.39 64.54,48.39 64.87,48.72 64.87,56.95 SEG2.10 ; SEG1.10 v1(33.95,54.69)
SEGG: length 53.5
  Top Layer w0.355: R9.2 47.78,44.54 47.35,44.98 39.52,44.98 39.07,45.44 39.07,46.84 SEG1.5 ; SEG2.5 70.05,46.89 70.05,51.36 69.47,51.94 v1(39.14,51.94)
  Bottom Layer w0.355: SEG1.5 39.14,46.98 v1(39.14,51.94)
SIG_IN: length 4.3
  Top Layer w0.355: 86.56,38.43 86.49,38.35 82.32,38.35
V_CS: length 35.5
  Top Layer w0.355: U7.30 33.1,11.25 32.74,10.9 26.47,10.9 26.24,10.67 v1(26.06,10.67) 26.06,7.29 R96.1 ; U12.4 37.09,3.8 v1(37.06,3.84)
  Bottom Layer w0.355: v1(37.06,3.84) 26.26,3.84 26.06,4.04 v1(26.06,10.67)
V_MISO: length 19.6
  Top Layer w0.355: R94.1 32.1,9.19 v1(32.13,9.22) 32.39,9.47 34.34,9.47 34.7,9.83 U7.32 ; U12.2 v1(39.19,7.8)
  Bottom Layer w0.355: v1(32.13,9.22) 32.08,9.17 32.08,7.98 32.25,7.8 v1(39.19,7.8)
V_MOSI: length 12.9
  Top Layer w0.355: 35.5,10.15 35.84,9.8 U12.1 ; 35.5,10.15 U7.33 ; 35.5,10.15 35.5,7.61 R93.1
V_SCLK: length 27.3
  Top Layer w0.355: v1(38.28,5.79) 38.29,5.8 U12.3 ; U7.31 33.9,10.54 33.54,10.19 29.49,10.19 29.16,9.85 29.16,7.35 R95.1
  Bottom Layer w0.355: v1(29.24,9.96) 29.21,9.93 29.21,6.12 29.54,5.79 v1(38.28,5.79)
VUSB: length 9.8
  Top Layer w0.762: 9.47,39.6 U1.16 ; 9.47,39.6 arc(8.94,39.82) 8.71,40.36 ; 9.47,39.6 arc(8.94,39.82) 8.71,40.36 ; CN1.1 8.71,40.36
$1N560: length 4
  Top Layer w0.254: 76.89,24.89 76.06,24.89 75.25,25.7 73.68,25.7 73.59,25.61 U3.2
$1N561: length 4
  Top Layer w0.254: X1.1 76.06,26.92 75.25,26.11 73.68,26.11 73.59,26.2 U3.3
$1N593: length 15.5
  Top Layer w1.27: B1.1 69.16,18.26 arc(69.2,18.35) v1(69.29,18.39) ; v1(69.14,22.33) 69.14,23.39 arc(69.01,23.7) 68.71,23.83 67.76,23.83 arc(67.64,23.88) U3.8
  Bottom Layer w1.27: v1(69.29,18.39) 69.29,22.17 arc(69.25,22.28) v1(69.14,22.33)
$1N596: length 32.4
  Top Layer w0.355: U4.14 55.14,31.05 55.14,28.82 54.84,28.52 53.15,28.52 52.63,27.99 52.63,16.23 52.36,15.96 U7.34
$1N597: length 37.5
  Top Layer w0.355: U4.13 53.87,31.05 53.87,29.49 53.61,29.23 52.86,29.23 51.92,28.29 51.92,24.79 51.59,24.46 40.59,24.46 ; 40.59,24.46 40.59,17.14 40.21,16.76 U7.35 ; 40.59,24.46 40.59,27.58 R12.2 39.47,27.99 39.17,28.3 U5.13
$1N598: length 36.8
  Top Layer w0.355: U4.12 52.59,29.89 52.56,29.94 50.95,28.33 v1(50.95,25.45) ; U5.12 37.92,31.07 37.92,27 38.25,26.67 39.22,26.67 39.52,26.36 v1(39.52,23.24) 39.52,17.88 39.2,17.56 U7.36
  Bottom Layer w0.355: v1(50.95,25.45) 50.95,23.47 50.73,23.24 v1(39.52,23.24)
$1N599: length 37.7
  Top Layer w0.355: U7.37 38.15,18.36 38.61,18.82 38.61,25.55 38.2,25.96 37.11,25.96 36.6,26.47 36.6,31.07 U5.11 36.63,34.8 36.91,35.08 51.03,35.08 51.26,34.85 51.26,31.13 U4.11
$1N600: length 4.3
  Top Layer w0.508: R1.1 21.72,40.84 21.72,41.96 21.54,42.14 U1.3
$1N601: length 4.5
  Top Layer w0.508: D1.1 20.2,40.55 19.89,40.87 U1.2
$1N604: length 3.2
  Top Layer w0.508: U1.4 C7.2
$1N605: length 13.2
  Top Layer w0.508: R15.2 12.83,51.94 12.83,53.27 11.5,53.27 10.99,52.76 9.98,52.76 9.47,53.27 8.22,53.27 8.04,53.09 8.04,51.91 8.36,51.6 8.36,50.39 8.04,50.07 8.04,48.83 8.71,48.16 CN1.2
$1N606: length 13.4
  Top Layer w0.508: R18.2 12.8,53.95 12.83,53.93 7.95,53.93 7.38,53.36 7.38,48.83 6.71,48.16 CN1.3
$1N607: length 18.1
  Top Layer w0.508: U1.6 18.67,45.8 18.77,45.69 20.37,45.69 20.93,46.25 20.93,48.94 20.68,49.19 20.68,50.17 20.93,50.42 20.93,51 20.36,51.57 20.36,51.89 20.84,52.36 20.84,53.06 20.75,53.15 19.26,53.15 18.75,52.64 18.75,52.21 18.24,51.7 17.73,51.7 17.23,52.21 17.23,52.64 16.72,53.15 16.37,53.15 R15.1
$1N608: length 18.1
  Top Layer w0.508: R18.1 16.32,53.81 21.04,53.81 21.59,53.26 21.59,45.98 20.64,45.03 18.85,45.03 18.67,44.85 U1.5
$1N627: length 20.6
  Top Layer w0.355: SW1.3 2.08,28.02 2.08,25.96 2.62,25.43 15.67,25.43 16.03,25.78 16.03,26.76
  Top Layer w0.762: 16.03,26.76 16.03,29.52 arc(16.11,29.71) R21.2
$1N632: length 5.1
  Top Layer w0.355: 80.04,38.76 79.86,38.58 79.86,37.85 79.02,37.01 76.06,37.01
$1N637: length 39.5
  Top Layer w0.355: U6.5 76.13,39.62 88.09,39.62 88.44,39.27 88.44,29.54 88.09,29.18 80.47,29.18 80.04,29.62 R92.1 79.98,31.04 78.84,31.04 78.51,31.37 78.51,34.14 78.18,34.47 U6.1
$1N638: length 10.2
  Top Layer w0.355: U6.2 78.77,35.74 79.53,34.98 R90.1 80.04,32.77 80.26,32.54 82.17,32.54 82.32,32.39 R92.2
$1N646: length 3.5
  Top Layer w0.355: U12.6 49.77,5.8 R98.1
$1N647: length 3.4
  Top Layer w0.355: U12.7 49.82,7.8 R97.1
$1N661: length 9.6
  Top Layer w0.355: R97.2 59.82,8.33 60.3,8.81 SP1.1
$1N662: length 9.8
  Top Layer w0.355: R98.2 60.02,5.23 60.3,4.95 SP1.2
$1N687: length 3.2
  Top Layer w0.355: R19.1 9.14,18.08 arc(9.16,18.05) LED1.1
$1N2494: length 19.3
  Top Layer w0.355: R11.2 66.98,39.95 66.98,35.28 66.67,34.98 56.54,34.98 56.4,34.83 U4.15
$1N2978: length 9.3
  Top Layer w0.355: R4.1 63.65,40.01 63.65,38.18 63.47,38 57.86,38 57.67,37.81 U4.1
$1N2981: length 7.2
  Top Layer w0.355: R5.1 60.51,39.05 60.17,38.71 56.72,38.71 56.4,38.39 U4.2
$1N2984: length 5.5
  Top Layer w0.355: U4.3 55.22,36.66 55.22,39.88 55.4,40.06 R6.1
$1N2987: length 3.6
  Top Layer w0.355: U4.4 53.86,39.77 R7.1
$1N2990: length 4.9
  Top Layer w0.355: U4.5 52.59,39.74 52.3,40.03 50.99,40.03 R8.1
$1N2993: length 6.6
  Top Layer w0.355: U4.6 51.32,38.47 50.88,38.91 48.01,38.91 47.78,39.13 R9.1
$1N2999: length 8.3
  Top Layer w0.355: R10.1 44.93,38.43 45.16,38.2 49.81,38.2 50.05,37.96 U4.7
$1N3336: length 14.5
  Top Layer w0.355: U4.9 48.77,31.08 48.77,34.16 48.57,34.37 40.89,34.37 40.44,33.91 U5.14

## Copper pours and planes (outline as drawn; the poured copper is in the pictures)
+5V on Top Layer: 53.29,23.09 64.21,23.09 64.21,20.68 53.29,20.68
+5V on Top Layer: 15.76,6.11 36.28,6.11 36.28,3.7 15.76,3.7
+5V on Top Layer: 8,25.02 26.83,25.02 26.83,21.64 8,21.64
GND on Top Layer: 47.04,37.81 49.12,37.81 49.12,35.46 47.04,35.46
GND on Top Layer: -9.8,68.38 98.86,68.38 98.86,-5.51 -9.8,-5.51
GND on Top Layer: 24.74,21.08 28.45,21.08 28.45,19.96 24.74,19.96
GND on Bottom Layer: -7.62,64.52 103.51,64.52 103.51,-8.08 -7.62,-8.08
ADC_CH3 on Top Layer: 74.83,42.55 77.27,42.55 77.27,40.42 74.83,40.42
VUSB on Top Layer: 5.05,40.08 14.68,40.08 14.68,25.93 5.05,25.93

Small or netless copper shapes (teardrops, artwork), in the pictures only: 210 on Top Layer, 54 on Bottom Layer
